# EAGLE design ATmega1284P (EAGLE 6.6.0)
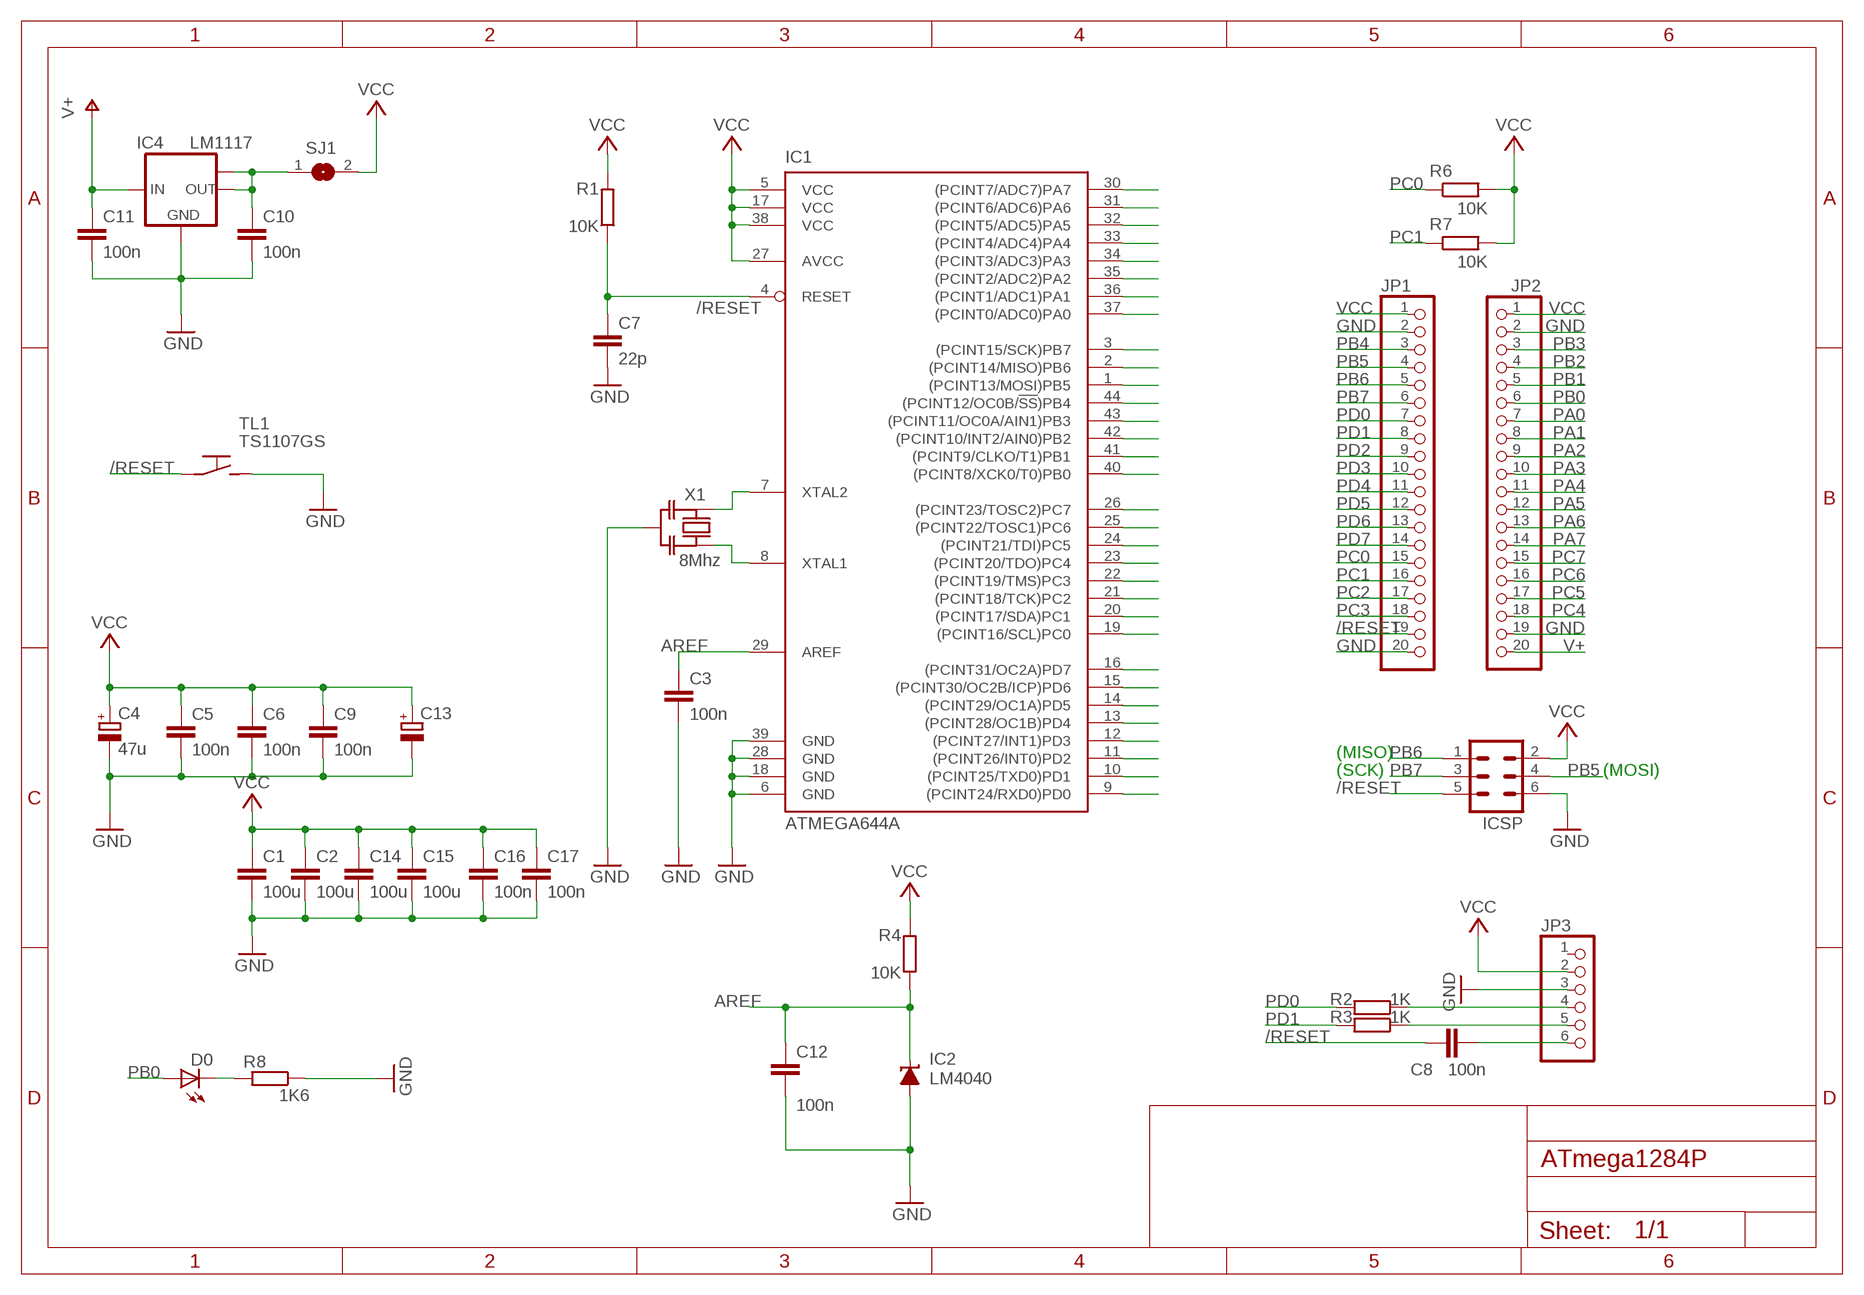
[diagram p0: schematic, sheet 1]

## Parts
C1  100u  C-EUC1206  [C1206]
C2  100u  C-EUC1206  [C1206]
C3  100n  C-EUC0805  [C0805]
C4  47u  CPOL-EUSMCA  [SMC_A]
C5  100n  C-EUC0805  [C0805]
C6  100n  C-EUC0805  [C0805]
C7  22p  C-EUC0805  [C0805]
C8  100n  C-EUC0805  [C0805]
C9  100n  C-EUC0805  [C0805]
C10  100n  C-EUC0805  [C0805]
C11  100n  C-EUC0805  [C0805]
C12  100n  C-EUC0805  [C0805]
C13  CPOL-EUSMCC  [SMC_C]
C14  100u  C-EUC1206  [C1206]
C15  100u  C-EUC1206  [C1206]
C16  100n  C-EUC0805  [C0805]
C17  100n  C-EUC0805  [C0805]
D0  LEDCHIPLED_0805  [CHIPLED_0805]
IC1  ATMEGA644A  [TQFP44]
IC2  LM4040  LM4041A12DBZ  [DBZ_R-PDSO-G3]
IC4  LM1117  LM1117IMPX-3.3  [SOT223]
ICSP  ML6  [ML6]
JP1  PINHD-1X20  [1X20]
JP2  PINHD-1X20  [1X20]
JP3  PINHD-1X6  [1X06]
R1  10K  R-EU_M0805  [M0805]
R2  1K  R-EU_M0805  [M0805]
R3  1K  R-EU_M0805  [M0805]
R4  10K  R-EU_M0805  [M0805]
R6  10K  R-EU_M0805  [M0805]
R7  10K  R-EU_M0805  [M0805]
R8  1K6  R-EU_M0805  [M0805]
SJ1  SJ  [SJ]
TL1  TS1107GS  [TS1107GS]
X1  8Mhz  CERMOSC-CERALOCK-CSTCE_G  [CERALOCK_CSTCE_G]

## Nets
/RESET: C7.2 C8.2 IC1.4(RESET) ICSP.5 JP1.19 R1.1 TL1.P$1(P)
AREF: C3.2 C12.1 IC1.29(AREF) IC2.1(C) R4.1
GND: C1.2 C2.2 C3.1 C4.- C5.1 C6.1 C7.1 C9.1 C10.2 C11.2 C12.2 C13.- C14.2 C15.2 C16.1 C17.1 IC1.6(GND) IC1.18(GND) IC1.28(GND) IC1.39(GND) IC2.2(A) IC4.1(GND) ICSP.6 JP1.2 JP1.20 JP2.2 JP2.19 JP3.3 R8.1 TL1.P$2(S) X1.P$2(GND)
N$1: C8.1 JP3.6
N$2: D0.C R8.2
N$3: IC1.7(XTAL2) X1.P$3
N$4: IC1.8(XTAL1) X1.P$1
N$6: C10.1 IC4.2(OUT) IC4.TAB(OUT1) SJ1.1
PA0: IC1.37((PCINT0/ADC0)PA0) JP2.7
PA1: IC1.36((PCINT1/ADC1)PA1) JP2.8
PA2: IC1.35((PCINT2/ADC2)PA2) JP2.9
PA3: IC1.34((PCINT3/ADC3)PA3) JP2.10
PA4: IC1.33((PCINT4/ADC4)PA4) JP2.11
PA5: IC1.32((PCINT5/ADC5)PA5) JP2.12
PA6: IC1.31((PCINT6/ADC6)PA6) JP2.13
PA7: IC1.30((PCINT7/ADC7)PA7) JP2.14
PB0: D0.A IC1.40((PCINT8/XCK0/T0)PB0) JP2.6
PB1: IC1.41((PCINT9/CLKO/T1)PB1) JP2.5
PB2: IC1.42((PCINT10/INT2/AIN0)PB2) JP2.4
PB3: IC1.43((PCINT11/OC0A/AIN1)PB3) JP2.3
PB4: IC1.44((PCINT12/OC0B/!SS!)PB4) JP1.3
PB5: IC1.1((PCINT13/MOSI)PB5) ICSP.4 JP1.4
PB6: IC1.2((PCINT14/MISO)PB6) ICSP.1 JP1.5
PB7: IC1.3((PCINT15/SCK)PB7) ICSP.3 JP1.6
PC0: IC1.19((PCINT16/SCL)PC0) JP1.15 R6.1
PC1: IC1.20((PCINT17/SDA)PC1) JP1.16 R7.1
PC2: IC1.21((PCINT18/TCK)PC2) JP1.17
PC3: IC1.22((PCINT19/TMS)PC3) JP1.18
PC4: IC1.23((PCINT20/TDO)PC4) JP2.18
PC5: IC1.24((PCINT21/TDI)PC5) JP2.17
PC6: IC1.25((PCINT22/TOSC1)PC6) JP2.16
PC7: IC1.26((PCINT23/TOSC2)PC7) JP2.15
PD0: IC1.9((PCINT24/RXD0)PD0) JP1.7 R2.2
PD1: IC1.10((PCINT25/TXD0)PD1) JP1.8 R3.2
PD2: IC1.11((PCINT26/INT0)PD2) JP1.9
PD3: IC1.12((PCINT27/INT1)PD3) JP1.10
PD4: IC1.13((PCINT28/OC1B)PD4) JP1.11
PD5: IC1.14((PCINT29/OC1A)PD5) JP1.12
PD6: IC1.15((PCINT30/OC2B/ICP)PD6) JP1.13
PD7: IC1.16((PCINT31/OC2A)PD7) JP1.14
RXD0: JP3.4 R2.1
TXD0: JP3.5 R3.1
V+: C11.1 IC4.3(IN) JP2.20
VCC: C1.1 C2.1 C4.+ C5.2 C6.2 C9.2 C13.+ C14.1 C15.1 C16.2 C17.2 IC1.5(VCC) IC1.17(VCC) IC1.27(AVCC) IC1.38(VCC) ICSP.2 JP1.1 JP2.1 JP3.2 R1.2 R4.2 R6.2 R7.2 SJ1.2
Unconnected: JP3.1

## Notes on the sheet
- (MISO)
- (SCK) | (MOSI)

## Library data of the parts
C1 C2 C14 C15 = rcl:C-EU: CAPACITOR, European symbol; TME: GRM31CR60J107ME39L
C3 C5-C12 C16 C17 = rcl:C-EU: CAPACITOR, European symbol
C4 C13 = rcl:CPOL-EU: POLARIZED CAPACITOR, European symbol
D0 = led:LED: LED OSRAM: - CHIPLED LG R971, LG N971, LY N971, LG Q971, LY Q971, LO R971, LY R971 LH N974, LH R974 LS Q976, LO Q976, LY Q976 LO Q996 - Hyper CHIPLED LW Q18S LB Q993, LB Q99A, LB R99A - SideLED LS A670, LO A670, LY A670, LG A670, LP A670 LB A673, LV A673, LT A673, LW A673 LH A674 LY A675 LS A676, LA A676, LO A676, LY A676, LW A676 LS A679, LY A679, LG A679 - Hyper Micro SIDELED® LS Y876, LA Y876, LO Y876, LY Y876 LT Y87S - SmartLED LW L88C, LW L88S LB L89C, LB L89S, LG L890 LS L89K, LO L89K, LY L89K LS L896, LA L896, LO L896, LY L896 - TOPLED LS T670, LO T670, LY T670, LG T670, LP T670 LSG T670, LSP T670, LSY T670, LOP T670, LYG T670 LG T671, LOG T671, LSG T671 LB T673, LV T673, LT T673, LW T673 LH T674 LS T676, LA T676, LO T676, LY T676, LB T676, LH T676, LSB T676, LW T676 LB T67C, LV T67C, LT T67C, LS T67K, LO T67K, LY T67K, LW E67C LS E67B, LA E67B, LO E67B, LY E67B, LB E67C, LV E67C, LT E67C LW T67C LS T679, LY T679, LG T679 LS T770, LO T770, LY T770, LG T770, LP T770 LB T773, LV T773, LT T773, LW T773 LH T774 LS E675, LA E675, LY E675, LS T675 LS T776, LA T776, LO T776, LY T776, LB T776 LHGB T686 LT T68C, LB T68C - Hyper Mini TOPLED® LB M676 - Mini TOPLED Santana® LG M470 LS M47K, LO M47K, LY M47K Source: http://www.osram.convergy.de LUXEON: - LUMILED® LXK2-PW12-R00, LXK2-PW12-S00, LXK2-PW14-U00, LXK2-PW14-V00 LXK2-PM12-R00, LXK2-PM12-S00, LXK2-PM14-U00 LXK2-PE12-Q00, LXK2-PE12-R00, LXK2-PE12-S00, LXK2-PE14-T00, LXK2-PE14-U00 LXK2-PB12-K00, LXK2-PB12-L00, LXK2-PB12-M00, LXK2-PB14-N00, LXK2-PB14-P00, LXK2-PB14-Q00 LXK2-PR12-L00, LXK2-PR12-M00, LXK2-PR14-Q00, LXK2-PR14-R00 LXK2-PD12-Q00, LXK2-PD12-R00, LXK2-PD12-S00 LXK2-PH12-R00, LXK2-PH12-S00 LXK2-PL12-P00, LXK2-PL12-Q00, LXK2-PL12-R00 Source: www.luxeon.com KINGBRIGHT: KA-3528ASYC Source: www.kingbright.com
IC1 = atmel:ATMEGA644: 8-bit Microcontroller with 64K Bytes In-System Programmable Flash Source: http://www.atmel.com/dyn/resources/prod_documents/doc2593.pdf; MPN: ATMEGA644PV-10AU; OC_FARNELL: 1455123; OC_NEWARK: 58M3748
IC2 = texas:LM4041: PRECISION MICROPOWER SHUNT VOLTAGE REFERENCE Source: http://focus.ti.com/lit/ds/slcs146e/slcs146e.pdf; MPN: LM4041A12IDBZR; OC_FARNELL: 1407949; OC_NEWARK: 58K5875
IC4 = lm1117:LM1117IMPX-*
ICSP = con-harting-ml:ML6: HARTING; OC_FARNELL: unknown; OC_NEWARK: unknown
JP1 JP2 = pinhead:PINHD-1X20: PIN HEADER
JP3 = pinhead:PINHD-1X6: PIN HEADER
R1-R4 R6-R8 = rcl:R-EU_: RESISTOR, European symbol
SJ1 = jumper:SJ: SMD solder JUMPER
TL1 = switch:TS1107GS
X1 = SteMarie:CERMOSC-*?

## Board
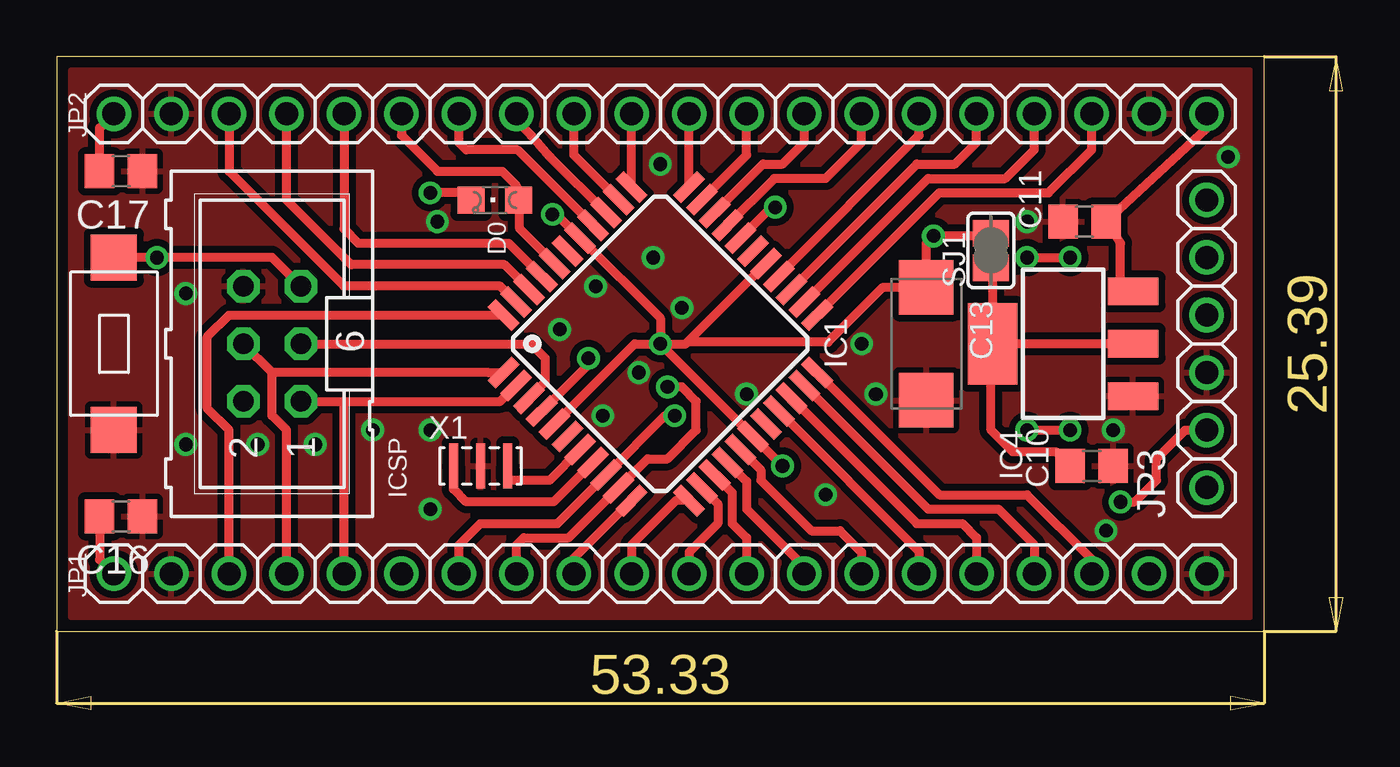
[diagram p1: board, top side]
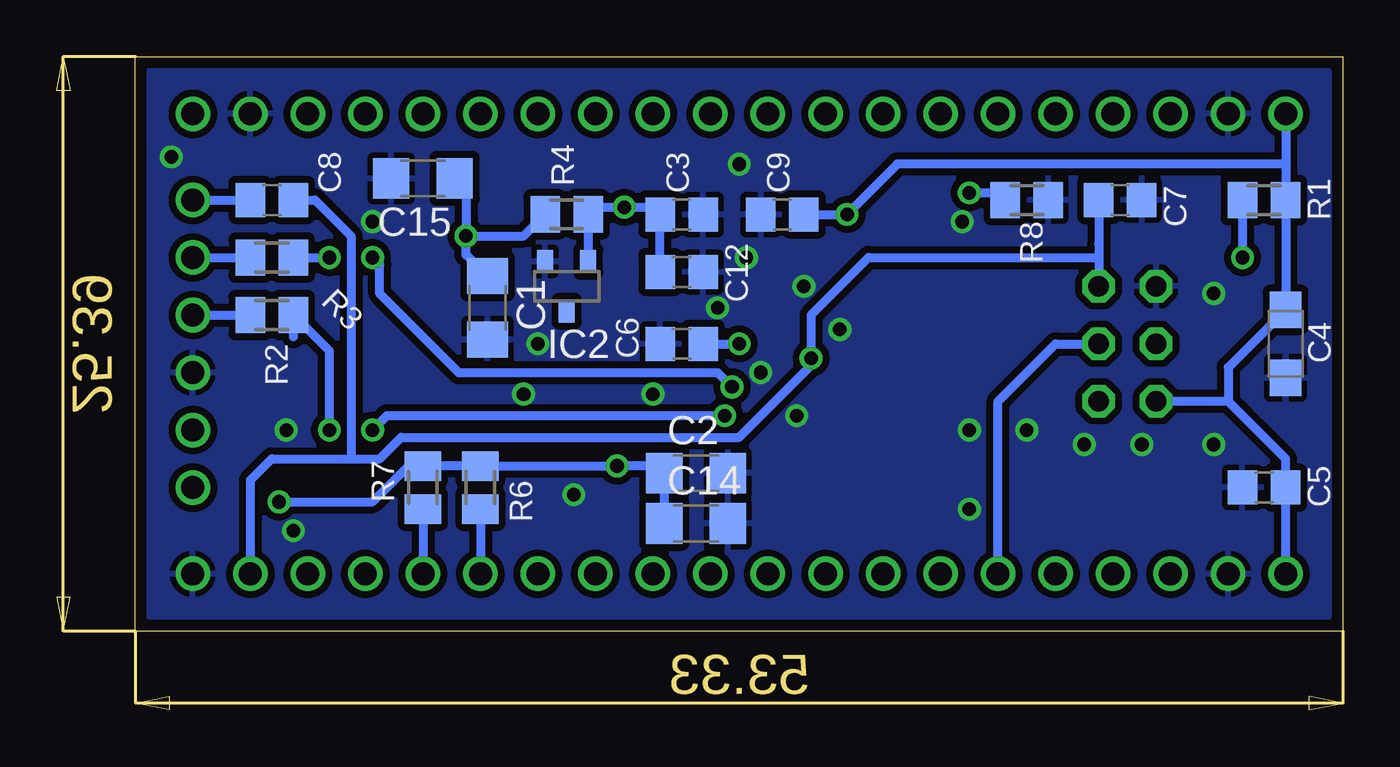
[diagram p2: board, bottom side, seen from below]

Size 53.33 x 25.39 mm. Coordinates in mm from the lower left corner, seen from the top.
Outline: 53.33,0 53.33,25.39 0,25.39 0,0 53.33,0
Copper layers (1*16): Top 0.035mm / dielectric 1.5mm / Bottom 0.035mm
Design rules "default *": minimum track width 10mil, minimum drill 16mil, track to track 8mil, track to pad 8mil, pad to pad 8mil, via to via 8mil, smd to smd 8mil, copper to edge 16mil, drill to drill 8mil, minimum pad ring 10mil, minimum via ring 8mil, stop-mask expansion 4mil, vias tented up to drill 0mil, thermal gap 10mil

### Footprints (pad centres in the part's own frame; a part is rotated, then mirrored left to right if it is on the bottom)
C1206 = smd 1.6 x 1.8: 1 -1.4,0; 2 1.4,0
C0805 = smd 1.3 x 1.5: 1 -0.95,0; 2 0.95,0
SMC_A = smd 1.6 x 1.4: + -1.5,0; - 1.5,0
SMC_C = smd 2.4 x 2.4: + -2.5,0; - 2.5,0
CHIPLED_0805 = smd 1.2 x 1.2: A 0,-1.05; C 0,1.05
TQFP44 = smd 1.5 x 0.5: 1 -5.8,4; 2 -5.8,3.2; 3 -5.8,2.4; 4 -5.8,1.6; 5 -5.8,0.8; 6 -5.8,0; 7 -5.8,-0.8; 8 -5.8,-1.6; 9 -5.8,-2.4; 10 -5.8,-3.2; 11 -5.8,-4; 23 5.8,-4; 24 5.8,-3.2; 25 5.8,-2.4; 26 5.8,-1.6; 27 5.8,-0.8; 28 5.8,0; 29 5.8,0.8; 30 5.8,1.6; 31 5.8,2.4; 32 5.8,3.2; 33 5.8,4 | smd 0.5 x 1.5: 12 -4,-5.8; 13 -3.2,-5.8; 14 -2.4,-5.8; 15 -1.6,-5.8; 16 -0.8,-5.8; 17 0,-5.8; 18 0.8,-5.8; 19 1.6,-5.8; 20 2.4,-5.8; 21 3.2,-5.8; 22 4,-5.8; 34 4,5.8; 35 3.2,5.8; 36 2.4,5.8; 37 1.6,5.8; 38 0.8,5.8; 39 0,5.8; 40 -0.8,5.8; 41 -1.6,5.8; 42 -2.4,5.8; 43 -3.2,5.8; 44 -4,5.8
DBZ_R-PDSO-G3 = smd 0.7 x 1: 1 -0.95,-1.1; 2 0.95,-1.1; 3 0,1.1
SOT223 = smd 1.219 x 2.235: 1 -2.311,-3.099; 2 0,-3.099; 3 2.311,-3.099 | smd 3.6 x 2.2: TAB 0,3.099
ML6 = drill 0.914 octagon: 1 -2.54,-1.27; 2 -2.54,1.27; 3 0,-1.27; 4 0,1.27; 5 2.54,-1.27; 6 2.54,1.27
1X20 = drill 1.016: 1 -24.13,0; 2 -21.59,0; 3 -19.05,0; 4 -16.51,0; 5 -13.97,0; 6 -11.43,0; 7 -8.89,0; 8 -6.35,0; 9 -3.81,0; 10 -1.27,0; 11 1.27,0; 12 3.81,0; 13 6.35,0; 14 8.89,0; 15 11.43,0; 16 13.97,0; 17 16.51,0; 18 19.05,0; 19 21.59,0; 20 24.13,0
1X06 = drill 1.016: 1 -6.35,0; 2 -3.81,0; 3 -1.27,0; 4 1.27,0; 5 3.81,0; 6 6.35,0
M0805 = smd 1.3 x 1.6: 1 -0.95,0; 2 0.95,0
SJ = smd 1.168 x 1.6: 1 -0.762,0; 2 0.762,0
TS1107GS = smd 2.032 x 2.032: P$1 -3.81,0; P$2 3.81,0
CERALOCK_CSTCE_G = smd 0.4 x 2: P$1 -1.2,0; P$2 0,0; P$3 1.2,0

### Placement (x,y rotation side)
C1  37.77,14.29 270 bottom
C2  28.56,6.99 0 bottom
C3  29.2,18.41 180 bottom
C4  2.53,12.7 270 bottom
C5  3.48,6.35 0 bottom
C6  29.2,12.7 0 bottom
C7  9.83,19.05 180 bottom
C8  47.3,19.05 0 bottom
C9  24.75,18.41 0 bottom
C10  45.71,7.3 0 top
C11  45.39,18.1 180 top
C12  29.2,15.88 0 bottom
C13  38.41,12.7 270 top
C14  28.56,4.76 0 bottom
C15  40.63,20 180 bottom
C16  2.85,5.08 180 top
C17  2.85,20.32 180 top
D0  19.36,19.05 90 top
IC1  26.66,12.7 45 top
IC2  34.28,15.24 180 bottom
IC4  44.44,12.7 90 top
ICSP  9.52,12.7 90 top
JP1  26.66,2.54 0 top
JP2  26.66,22.86 0 top
JP3  50.79,12.7 90 top
R1  3.48,19.05 0 bottom
R2  47.3,13.97 0 bottom
R3  47.3,16.51 0 bottom
R4  34.28,18.41 180 bottom
R6  38.09,6.35 90 bottom
R7  40.63,6.35 90 bottom
R8  13.96,19.05 180 bottom
SJ1  41.27,16.83 90 top
TL1  2.53,12.7 270 top
X1  18.72,7.3 0 top

### Tracks (layer width: path | path; a pad name or v marks a point on that pad's centre or on a via)
/RESET  (via drill 0.6, 0.6 pad 0.25)
  Top 0.406: ICSP.5 9.52,16.51 v4.44,16.51 TL1.P$1 | v23.48,12.06 23.48,11.79 IC1.4
  Bottom 0.406: C7.2 10.79,17.15 10.79,16.51 | 10.79,16.51 ICSP.5 | R1.1 4.44,18.41 v4.44,16.51 | 10.79,16.51 20.94,16.51 23.48,13.97 v23.48,12.06 23.48,11.75 26.66,8.57 41.58,8.57 42.54,7.62 43.8,7.62 | 43.8,7.62 47.3,7.62 48.25,6.67 JP1.19 | C8.2 45.39,19.05 43.8,17.46 43.8,7.62
AREF  (via drill 0.6)
  Top 0.406: IC1.29 31.24,18.41 31.56,18.73 v31.74,18.73
  Bottom 0.406: C12.1 C3.2 30.15,18.73 v31.74,18.73 33.01,18.73 R4.1 IC2.1
GND  (via drill 0.6)
  other vias: 23.8,15.24 25.71,11.43 30.47,10.48 33.96,6.03 26.34,16.51 35.55,12.7 24.12,9.53 16.5,8.89 16.5,5.4 13.96,8.89 11.42,8.26 8.88,8.26 5.71,8.26 5.71,14.92 46.66,8.89 51.74,20.95 42.85,18.1 36.19,10.48 46.34,4.45 22.21,13.34 27.61,14.29 16.82,18.1 26.66,20.64
  pour Bottom (isolate 0.305): 0.62,0.64 52.7,0.64 52.7,24.77 0.62,24.77
  pour Top (isolate 0.305, rank 6): 0.62,0.64 52.7,0.64 52.7,24.77 0.62,24.77
N$1
  Bottom 0.406: JP3.6 C8.1
N$2  (via drill 0.6 pad 0.25)
  Top 0.406: D0.C 18.09,19.05 17.77,19.37 v16.5,19.37
  Bottom 0.406: v16.5,19.37 15.55,19.37 15.23,19.05 R8.2
N$3
  Top 0.406: IC1.7 21.76,6.67 19.99,6.67 19.92,6.74 X1.P$3
N$4
  Top 0.406: IC1.8 21.94,5.71 18.09,5.71 17.52,6.28 X1.P$1
N$6
  Top 0.406: IC4.2 IC4.TAB | 40.71,11.36 41.08,12.15 | 41.08,12.15 IC4.TAB | IC4.TAB 41.34,15.99 SJ1.1 | 41.08,12.15 41.27,11.97 41.27,8.89 42.22,7.94 44.12,7.94 C10.1
PA0
  Top 0.406: IC1.37 20.35,21.27 18.09,21.27 17.77,21.59 JP2.7
PA1
  Top 0.406: IC1.36 21.8,20.95 20.94,21.91 20.31,22.54 JP2.8
PA2
  Top 0.406: IC1.35 22.85,21.04 JP2.9
PA3
  Top 0.406: IC1.34 JP2.10
PA4
  Top 0.406: IC1.33 JP2.11
PA5
  Top 0.406: IC1.32 30.47,21.04 JP2.12
PA6
  Top 0.406: JP2.13 33.01,21.59 32.06,20.64 31.2,20.64 IC1.31
PA7
  Top 0.406: IC1.30 31.7,20 33.96,20 35.55,21.59 JP2.14
PB0
  Top 0.406: IC1.40 20.45,17.78 20.45,19.01 D0.A 20.31,19.15 20.31,19.68 19.67,20.32 16.82,20.32 15.23,21.91 JP2.6
PB1
  Top 0.406: JP2.5 12.69,17.78 13.33,17.14 19.95,17.14 IC1.41
PB2
  Top 0.406: IC1.42 19.77,16.19 13.01,16.19 10.15,19.05 JP2.4
PB3
  Top 0.406: JP2.3 7.61,20.32 12.69,15.24 19.59,15.24 IC1.43
PB4
  Top 0.406: JP1.3 7.61,8.89 6.66,9.84 6.66,13.02 7.61,13.97 IC1.44
PB5
  Top 0.406: JP1.4 10.15,8.89 9.52,9.53 9.52,11.43 | 9.52,11.43 ICSP.4 | 9.52,11.43 19.09,11.43 IC1.1
PB6
  Top 0.406: JP1.5 12.69,10.16 | IC1.2 19.59,10.16 12.69,10.16 | ICSP.1 12.69,10.16
PB7
  Top 0.406: ICSP.3 20.94,12.7 21.58,12.06 21.58,11.01 IC1.3
  Bottom 0.406: JP1.6 15.23,10.16 12.69,12.7 ICSP.3
PC0
  Top 0.406: IC1.19 38.09,3.53 JP1.15
  Bottom 0.406: R6.1 JP1.15
PC1
  Top 0.406: IC1.20 37.99,4.76 40,4.76 40.63,4.13 JP1.16
  Bottom 0.406: R7.1 JP1.16
PC2
  Top 0.406: IC1.21 38.49,5.4 41.58,5.4 43.17,3.81 JP1.17
PC3
  Top 0.406: IC1.22 38.98,6.03 42.85,6.03 45.71,3.17 JP1.18
PC4
  Top 0.406: IC1.23 38.98,19.37 43.8,19.37 45.71,21.27 JP2.18
PC5
  Top 0.406: IC1.24 38.49,20 41.9,20 43.17,21.27 JP2.17
PC6
  Top 0.406: IC1.25 37.99,20.64 39.68,20.64 40.63,21.59 JP2.16
PC7
  Top 0.406: IC1.26 31.89,15.71 38.09,21.91 JP2.15
PD0  (via drill 0.6)
  Top 0.406: JP1.7 17.77,3.81 18.72,4.76 22.12,4.76 IC1.9 26.88,9.53 v27.29,9.53 | v42.85,8.89 v44.76,8.89
  Bottom 0.406: v42.85,8.89 42.22,9.53 v27.29,9.53 | 46.35,13.02 R2.2 44.76,12.38 v44.76,8.89
PD1  (via drill 0.6)
  Top 0.406: JP1.8 20.31,3.81 20.63,4.13 22.61,4.13 IC1.10 26.1,7.62 26.98,7.62 28.25,8.89 28.25,10.16 27.61,10.79 v26.98,10.79 | v42.85,16.51 v44.76,16.51
  Bottom 0.406: v26.98,10.79 27.61,11.43 39.04,11.43 42.54,14.92 42.54,16.19 v42.85,16.51 | R3.2 v44.76,16.51
PD2
  Top 0.406: IC1.11 22.85,3.23 JP1.9
PD3
  Top 0.406: IC1.12 27.35,5.77 25.39,3.81 JP1.10
PD4
  Top 0.406: IC1.13 29.2,5.63 29.2,4.76 27.93,3.49 JP1.11
PD5
  Top 0.406: IC1.14 29.83,6.13 29.83,4.76 30.47,4.13 JP1.12
PD6
  Top 0.406: IC1.15 30.47,6.63 30.47,5.4 33.01,2.86 JP1.13
PD7
  Top 0.406: IC1.16 31.1,7.12 31.1,6.67 33.33,4.45 34.6,4.45 35.55,3.49 JP1.14
RXD0
  Bottom 0.406: JP3.4 R2.1
TXD0
  Bottom 0.406: JP3.5 R3.1
V+
  Top 0.406: IC4.3 46.98,15.01 46.98,17.14 C11.1 50.79,22.23 JP2.20
VCC  (via drill 0.6)
  Top 0.406: IC1.5 25.53,12.7 v26.66,12.7 | v26.66,12.7 27.79,12.7 27.86,12.77 | 27.86,12.77 IC1.27 | v26.66,12.7 26.66,13.83 IC1.38 22.08,18.41 v21.9,18.41 | v26.66,12.7 IC1.17 v32.06,7.3 | 27.86,12.77 34.07,12.77 36.5,15.2 C13.+ 38.41,17.14 v38.73,17.46 | SJ1.2 40.5,17.46 v38.73,17.46 | v38.73,17.46 38.41,17.46 | v46.98,5.71 47.62,5.71 48.57,6.67 48.57,7.62 49.84,8.89 JP3.2 | C17.2 1.9,22.23 JP2.1 | C16.2 1.9,3.17 JP1.1
  Bottom 0.406: 2.53,20.64 JP2.1 2.53,22.23 | 2.53,20.64 R1.2 C4.+ 5.07,11.66 5.07,10.16 | JP1.1 C5.2 2.53,7.62 5.07,10.16 | 5.07,10.16 ICSP.2 | 2.53,20.64 19.67,20.64 v21.9,18.41 C9.2 | C6.2 v26.66,12.7 | v46.98,5.71 42.85,5.71 41.27,7.3 R7.2 R6.2 32.7,7.3 v32.06,7.3 30.28,7.3 C2.1 C14.1 | C15.1 38.73,19.5 v38.73,17.46 | v38.73,17.46 36.18,17.46 R4.2 | C1.1 38.73,16.64 v38.73,17.46

### Text on the board
tTest: VCC | GND | PWM | A0 | A1 | A2 | A3 | A4 | A5 | A6 | A7 | GND | V+ | D3 | D2 | D1 | D0 | D24 | D25 | D26 | D27 | D28 | D29 | D30 | D31 | D23 | D22 | D21 | D20 | DTR | TX0 | RX0 | GND | VCC | D4 | D5 | D6 | D7 | D8 | D9 | D10 | D11 | D12 | D13 | D14 | D15 | D16 | D17 | D18 | D19 | VCC | GND | PWM | Rx0 | Tx0 | Rx1 | Tx1 | PWM | PWM | PWM | PWM | SCL | SDA | RST/ | GND